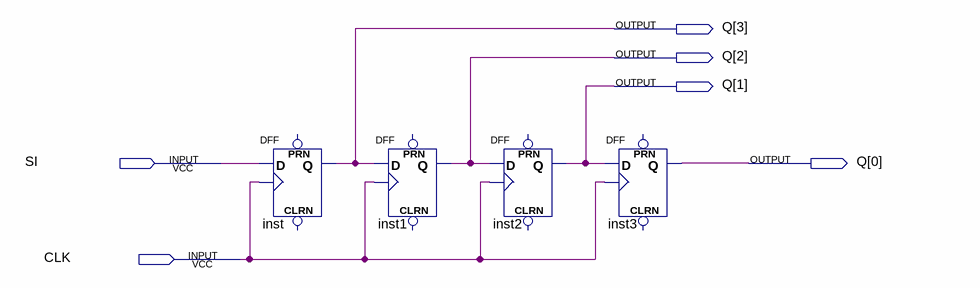
[diagram p0: schematic sheet]
// Quartus schematic cloques.bdf as structural Verilog: 4 symbols, 6 pins
module cloques (
  input  SI,
  input  CLK,
  output [3:0] Q
);

  DFF inst (.CLK(CLK), .D(SI), .Q(Q[3]));  // open: CLRN, PRN
  DFF inst1 (.CLK(CLK), .D(Q[3]), .Q(Q[2]));  // open: CLRN, PRN
  DFF inst2 (.CLK(CLK), .D(Q[2]), .Q(Q[1]));  // open: CLRN, PRN
  DFF inst3 (.CLK(CLK), .D(Q[1]), .Q(Q[0]));  // open: CLRN, PRN
endmodule
